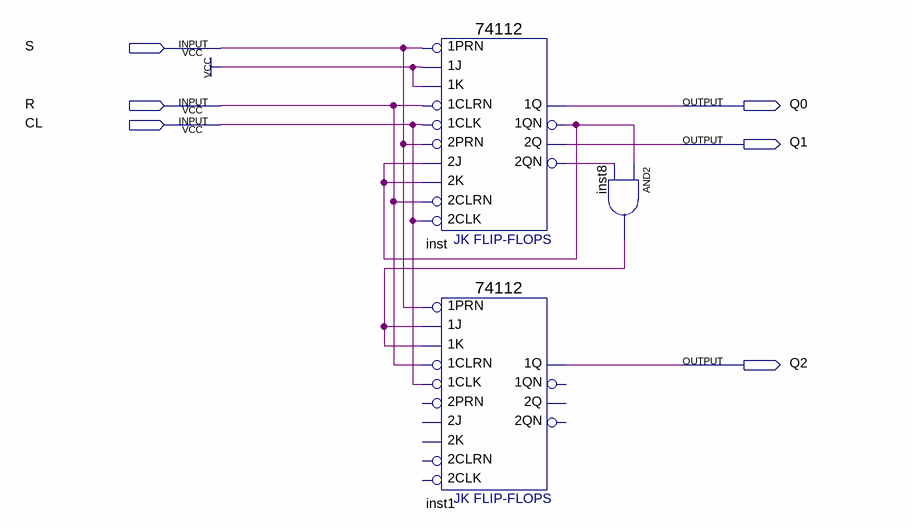
[diagram p0: schematic sheet]
// Quartus schematic ex1.bdf as structural Verilog: 3 symbols, 6 pins
module ex1 (
  input  S,
  input  R,
  input  CL,
  output Q0,
  output Q1,
  output Q2
);

  wire inst8_out, inst_1qn, inst_2qn;

  \74112  inst (
    .\1K (1'b1), .\1J (1'b1), .\1PRN (S), .\1CLK (CL), .\1CLRN (R), .\2K (inst_1qn), .\2J (inst_1qn),
    .\2PRN (S), .\2CLK (CL), .\2CLRN (R), .\1QN (inst_1qn), .\2Q (Q1), .\1Q (Q0), .\2QN (inst_2qn));
  \74112  inst1 (
    .\1K (inst8_out), .\1J (inst8_out), .\1PRN (S), .\1CLK (CL), .\1CLRN (R), .\1Q (Q2));  // open: 2K, 2J, 2PRN, 2CLK, 2CLRN, 1QN, 2Q, 2QN
  and inst8 (inst8_out, inst_1qn, inst_2qn);
endmodule
